# Altium schematic sheet Sensor.SchDoc
size B; Organization: ORGANIZATION; Address1: ADDRESS 1; Address2: ADDRESS 2; Address3: ADDRESS 3; Address4: ADDRESS 4; Revision: -; SheetNumber: 5; SheetTotal: 7; ENG_APP_DATE: --/--/--; DSN_APP_DATE: --/--/--; CHK_APP_DATE: --/--/--
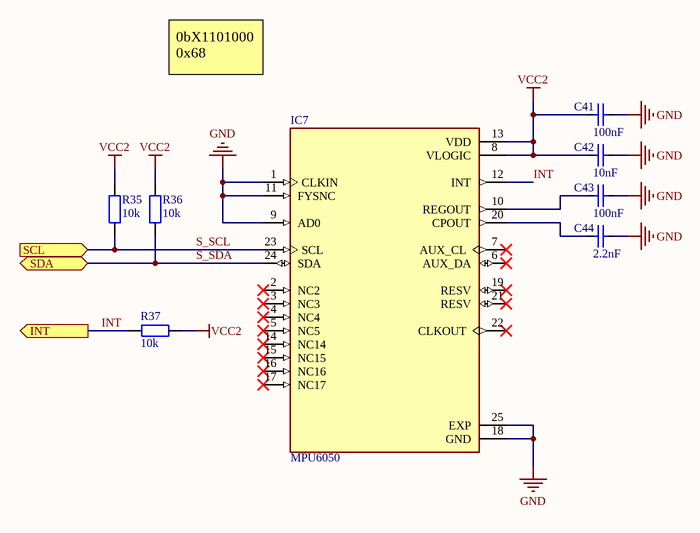
[diagram p0: Sensor.SchDoc]

## Parts
C41  100nF  [CAP_0603]
C42  10nF  [CAP_0603]
C43  100nF  [CAP_0603]
C44  2.2nF  [CAP_0603]
IC7  MPU6050  [QFN24]
R35  10k  [RES-SMD-0603]
R36  10k  [RES-SMD-0603]
R37  10k  [RES-SMD-0603]

## Ports
INT (out), SCL (in), SDA (bidir)

## Nets
GND: C41.1 C42.1 C43.1 C44.1 IC7.1(CLKIN) IC7.9(AD0) IC7.11(FYSNC) IC7.18(GND) IC7.25(EXP)
VCC2: C41.2 C42.2 IC7.8(VLOGIC) IC7.13(VDD) R35.2 R36.2 R37.1
INT: IC7.12(INT) R37.2 ; port INT
S_SCL: IC7.23(SCL) R35.1 ; port SCL
S_SDA: IC7.24(SDA) R36.1 ; port SDA
NetC43_2: C43.2 IC7.10(REGOUT)
NetC44_2: C44.2 IC7.20(CPOUT)

Not connected (* = marked no-connect by the designer): IC7 2(NC2)* 3(NC3)* 4(NC4)* 5(NC5)* 6(AUX_DA)* 7(AUX_CL)* 14(NC14)* 15(NC15)* 16(NC16)* 17(NC17)* 19(RESV)* 21(RESV)* 22(CLKOUT)*

## Notes on the sheet
- 0bX1101000
  0x68
- DWG. NO.
- REV.
- SHT.
- THIS DOCUMENT AND THE DATA DISCLOSED HEREIN OR HEREWITH IS THE PROPERTY OF ALTIUM LIMITED AND MAY BE FREELY DISTRIBUTED IN WHOLE. NO RIGHTS ARE RESERVED OR EXPRESS OR IMPLIED WARANTEE GIVEN.
- REVISION
- DESCRIPTION
- DATE
- APPROVED
- ENG:
- APPROVALS
- PROJECT
- DSN:
- CHK:
- REFERENCE DOCUMENTS
- PROJECT REVISION:
- TITLE
- DOCUMENT REVISION:
- DESIGN ITEM:
- BOM:
- FAB DWG:
- PCB DWG:
- ASSY DWG:
- SCALE:
- SIZE
- B
- CAGE CODE
- FILE NAME
- DWG NO.
- SHEET
- OF
- REV

## Library data of the parts
C41-C44 = CapSMD: Capacitor; Value: 33p; Published: 8-Jun-2000; LatestRevisionDate: 17-Jul-2002; LatestRevisionNote: Re-released for DXP Platform.; PackageReference: RAD-0.3; Publisher: Altium Limited
IC7 = MPU6050_Chip: 3-axis gyroscope, 3-axis accelerometer
R35-R37 = Resistor - SMD: Resistor SMD; Manufacturer: Generic Components; Class: Passive; Published: 08/06/2000; Publisher: Altium Hobart Technology Centre